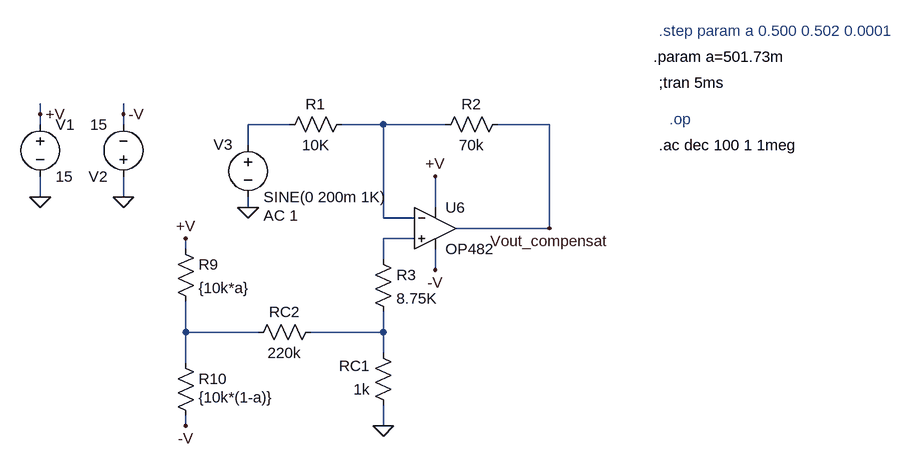
[diagram p0: schematic Etaj 1 - COMPENSARE.asc]
Etaj 1 - COMPENSARE.asc, the LTspice schematic file:
Version 4.1
SHEET 1 964 1668
WIRE -960 432 -960 416
WIRE -832 432 -832 416
WIRE -960 448 -960 432
WIRE -832 448 -832 432
WIRE -576 448 -640 448
WIRE -432 448 -496 448
WIRE -336 448 -432 448
WIRE -176 448 -256 448
WIRE -640 480 -640 448
WIRE -960 560 -960 528
WIRE -832 560 -832 528
WIRE -640 576 -640 560
WIRE -352 576 -352 528
WIRE -432 592 -432 448
WIRE -384 592 -432 592
WIRE -176 608 -176 448
WIRE -176 608 -320 608
WIRE -384 624 -432 624
WIRE -736 640 -736 624
WIRE -432 656 -432 624
WIRE -352 672 -352 640
WIRE -736 768 -736 720
WIRE -624 768 -736 768
WIRE -432 768 -432 736
WIRE -432 768 -544 768
WIRE -432 800 -432 768
WIRE -736 816 -736 768
WIRE -736 912 -736 896
WIRE -432 912 -432 880
FLAG -960 560 0
FLAG -832 560 0
FLAG -960 432 +V
FLAG -832 432 -V
FLAG -176 608 Vout_compensat
FLAG -736 624 +V
FLAG -736 912 -V
FLAG -352 528 +V
FLAG -352 672 -V
FLAG -640 576 0
FLAG -432 912 0
DATAFLAG -240 608 ""
SYMBOL voltage -960 432 R0
WINDOW 123 0 0 Left 2
WINDOW 39 0 0 Left 2
SYMATTR InstName V1
SYMATTR Value 15
SYMBOL voltage -832 544 R180
WINDOW 123 0 0 Left 2
WINDOW 39 0 0 Left 2
SYMATTR InstName V2
SYMATTR Value 15
SYMBOL res -480 432 R90
WINDOW 0 0 56 VBottom 2
WINDOW 3 32 56 VTop 2
SYMATTR InstName R1
SYMATTR Value 10K
SYMBOL res -448 640 R0
SYMATTR InstName R3
SYMATTR Value 8.75K
SYMBOL res -416 896 R180
WINDOW 0 36 76 Left 2
WINDOW 3 36 40 Left 2
SYMATTR InstName RC1
SYMATTR Value 1k
SYMBOL res -640 784 R270
WINDOW 0 32 56 VTop 2
WINDOW 3 0 56 VBottom 2
SYMATTR InstName RC2
SYMATTR Value 220k
SYMBOL res -752 624 R0
SYMATTR InstName R9
SYMATTR Value {10k*a}
SYMBOL res -752 800 R0
WINDOW 3 36 68 Left 2
SYMATTR Value {10k*(1-a)}
SYMATTR InstName R10
SYMBOL OpAmps\\OP482 -352 544 R0
SYMATTR InstName U6
SYMBOL res -240 432 R90
WINDOW 0 0 56 VBottom 2
WINDOW 3 32 56 VTop 2
SYMATTR InstName R2
SYMATTR Value 70k
SYMBOL voltage -640 464 R0
WINDOW 123 24 124 Left 2
WINDOW 39 0 0 Left 0
WINDOW 0 -53 15 Left 2
SYMATTR Value2 AC 1
SYMATTR InstName V3
SYMATTR Value SINE(0 200m 1K)
TEXT -16 344 Left 2 !.param a=501.73m
TEXT -8 384 Left 2 !;tran 5ms
TEXT 8 440 Left 2 ;.op
TEXT -8 304 Left 2 ;.step param a 0.500 0.502 0.0001
TEXT -8 480 Left 2 !.ac dec 100 1 1meg

The netlist it stands for:
* Etaj 1 - COMPENSARE.asc
V1 +V 0 15
V2 0 -V 15
R1 N002 N001 10K
R3 N003 N005 8.75K
RC1 0 N005 1k
RC2 N004 N005 220k
R9 +V N004 {10k*a}
R10 N004 -V {10k*(1-a)}
X§U6 N003 N002 +V -V Vout_compensat OP482  ; pins In+ In- V+ V- OUT
R2 Vout_compensat N002 70k
V3 N001 0 SINE(0 200m 1K) AC 1
.param a=501.73m
;tran 5ms
* .op
* .step param a 0.500 0.502 0.0001
.ac dec 100 1 1meg
.backanno
.end